# Altium schematic sheet SerialCom.SchDoc
size A4; SheetNumber: 9; SheetTotal: 9
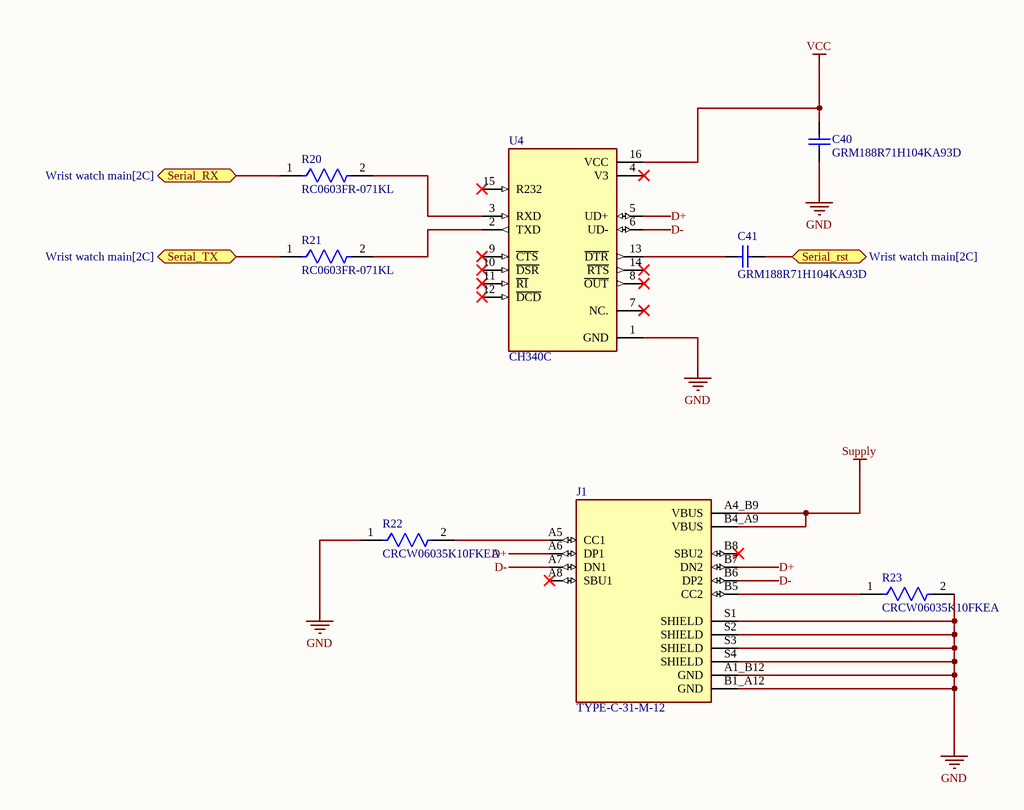
[diagram p0: SerialCom.SchDoc]

## Parts
C40  GRM188R71H104KA93D  [CAPC1608X90X35ML10T15]
C41  GRM188R71H104KA93D  [CAPC1608X90X35ML10T15]
J1  TYPE-C-31-M-12  [HRO_TYPE-C-31-M-12]
R20  RC0603FR-071KL  [FP-RC0603-0_55-IPC_C]
R21  RC0603FR-071KL  [FP-RC0603-0_55-IPC_C]
R22  CRCW06035K10FKEA  [FP-CRCW0603-e3-IPC_C]
R23  CRCW06035K10FKEA  [FP-CRCW0603-e3-IPC_C]
U4  CH340C  [SOIC127P600X180-16N]

## Ports
Serial_rst (bidir, see Wrist watch main[2C]), Serial_RX (bidir, see Wrist watch main[2C]), Serial_TX (bidir, see Wrist watch main[2C])

## Nets
GND: C40.1 J1.A1_B12(GND) J1.B1_A12(GND) J1.S1(SHIELD) J1.S2(SHIELD) J1.S3(SHIELD) J1.S4(SHIELD) R22.1 R23.2 U4.1(GND)
Supply: J1.A4_B9(VBUS) J1.B4_A9(VBUS)
VCC: C40.2 U4.16(VCC)
D+: J1.A6(DP1) J1.B7(DN2) U4.5(UD+)
D-: J1.A7(DN1) J1.B6(DP2) U4.6(UD-)
Serial_rst: C41.2 ; port Serial_rst
Serial_RX: R20.1 ; port Serial_RX
Serial_TX: R21.1 ; port Serial_TX
NetC41_1: C41.1 U4.13(~{DTR})
NetJ1_A5: J1.A5(CC1) R22.2
NetJ1_B5: J1.B5(CC2) R23.1
NetR20_2: R20.2 U4.3(RXD)
NetR21_2: R21.2 U4.2(TXD)

Not connected (* = marked no-connect by the designer): J1 A8(SBU1)* B8(SBU2)*; U4 4(V3)* 7(NC.)* 8(~{OUT})* 9(~{CTS})* 10(~{DSR})* 11(~{RI})* 12(~{DCD})* 14(~{RTS})* 15(R232)*

## Notes on the sheet
- Title:
- Size:
- Document Number :
- Revision
- Drawn by:
- Checked by:
- Date:
- A4
- Time:
- Aprooved by:
- Sheet:
- of
- File:

## Library data of the parts
C40 C41 = CMP-2100-03643-1: Chip Capacitor, 0.1 uF, +/- 10%, 50 V, -55 to 125 degC, 0603 (1608 Metric), RoHS, Tape and Reel; Manufacturer: Murata; Dielectric Material: Ceramic; Voltage Rating: 50V; Capacitance: 100nF; Dielectric: X7R; Insulation Resistance: 10GR; Case Code (Metric): 1608; Lead Free: LeadFree; Depth: 0.8mm; Number of Pins: 2; Radiation Hardening: No; Case/Package: 0603; Manufacturer URL: http://www.murata.com/; Packaging: TapeandReel; Length: 1.6mm; Contact Plating: Tin; Datasheet URL: http://psearch.en.murata.com/capacitor/product/GRM188R71H104KA93%23.pdf; Tolerance: 10%; Case Code (Imperial): 0603; Min Operating Temperature: -55degC; RoHSCompliant: true; Voltage: 50V; Termination: SMD/SMT; Mount: SurfaceMount; Material: Ceramic; Package Quantity: 1; Height: 0.8mm; Thickness: 0.035inch; REACH SVHC: NoSVHC; Max Operating Temperature: 125degC; Width: 0.8mm; Package Reference: 0603; Voltage Rating (DC): 50V; Datasheet Version: 42675.0; Package Description: 2-Pin Surface Mount Device, Body 1.6 x 0.8 mm
J1 = TYPE-C-31-M-12: USB Connectors 24 Receptacle 1 8.94*7.3mm RoHS; MF: HRO Electronics Co., Ltd.; Price: None; Value: *; SnapEDA_Link: https://www.snapeda.com/parts/TYPE-C-31-M-12/HRO+Electronics+Co.%252C+Ltd./view-part/?ref=snap; Package: Package; Availability: Not in stock; Check_prices: https://www.snapeda.com/parts/TYPE-C-31-M-12/HRO+Electronics+Co.%252C+Ltd./view-part/?ref=eda; MP: TYPE-C-31-M-12
R20 R21 = CMP-1659-00009-5: RES 1K OHM 1% 1/10W 0603; Resistance: 1kR; Voltage Rating: 50V; Power Rating: 100mW; Temperature Coefficient: 100ppm/°C; Military Standard: Not; REACH SVHC: No SVHC; Size Code: 0603; Features: Moisture Resistant; Number of Terminations: 2; Technology: THICK FILM; Series: RC; Case Code (Metric): 1608; Resistance Tolerance: 1%; Resistor Type: Thick Film; Termination: SMD/SMT; Contact Plating: Tin; Radiation Hardening: No; Min Operating Temperature: -55°C; Max Operating Temperature: 155°C; Packaging: Tape and Reel; Max Power Dissipation: 100mW; RoHS Compliant: Yes; Height: 0.45mm; Lead Free: Lead Free; Case/Package: 0603; Length: 1.6mm; Tolerance: 1%; Case Code (Imperial): 0603; Construction: Rectangular; Depth: 0.8mm
R22 R23 = CMP-1012-00590-3: RES Thick Film, 5.1kΩ, 1%, 0.1W, 100ppm/°C, 0603; Power Rating: 100mW; Voltage Rating (DC): 75V; Resistance: 5.1kR; Width: 0.85mm; Depth: 0.85mm; Military Standard: Not; Package Quantity: 5000; Case Code (Metric): 1608; Length: 1.55mm; Weight: 7.1E-05oz; Packaging: Tape and Reel; Temperature Coefficient: 100ppm/°C; Case Code (Imperial): 0603; Lead Free: Lead Free; Radiation Hardening: No; Contact Plating: Tin; Composition: Thick Film; Max Operating Temperature: 155°C; Termination: SMD/SMT; Case/Package: 0603; Min Operating Temperature: -55°C; Tolerance: 1%; Voltage Rating: 75V; Mount: Surface Mount; Height: 0.45mm
U4 = CH340C: USB to serial chip CH340; MF: WCH; Price: None; Availability: Not in stock; MP: CH340C; Package: None; SnapEDA_Link: https://www.snapeda.com/parts/CH340C/WCH/view-part/?ref=snap; Check_prices: https://www.snapeda.com/parts/CH340C/WCH/view-part/?ref=eda; Value: *